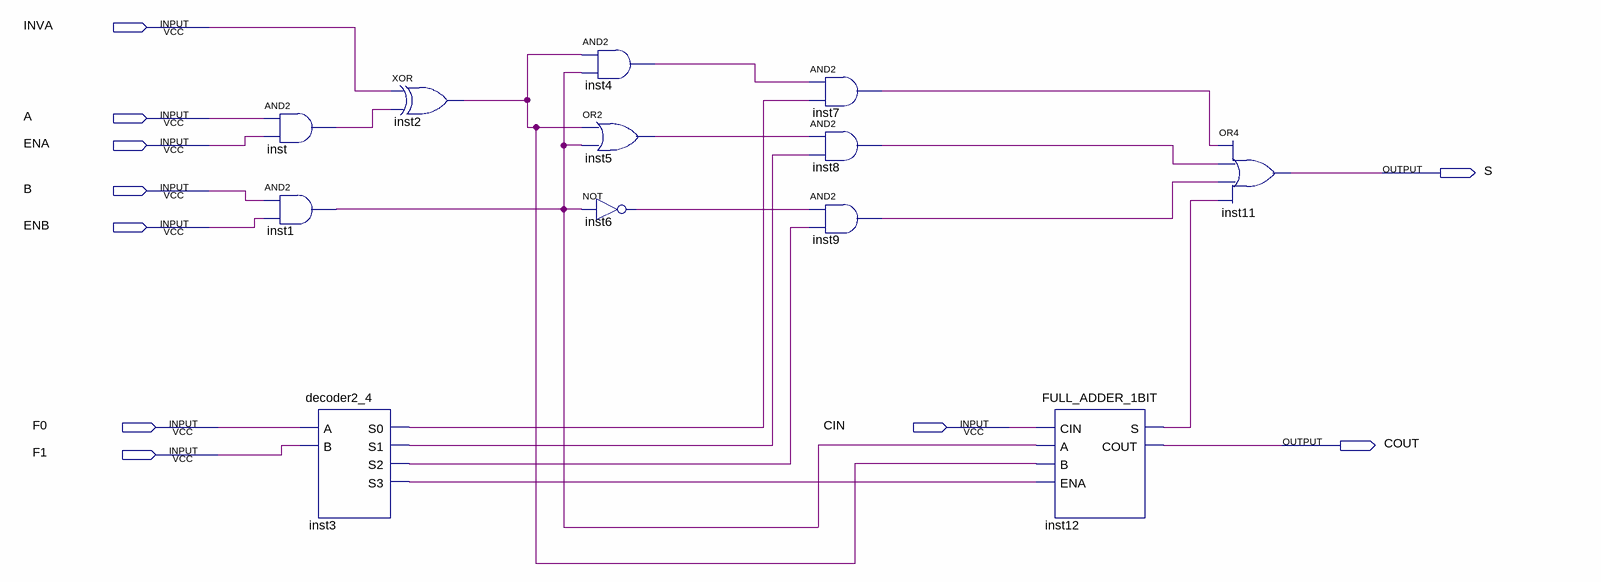
[diagram p0: schematic sheet]
// Quartus schematic ULA_1BIT.bdf as structural Verilog: 12 symbols, 10 pins
module ULA_1BIT (
  input  INVA,
  input  A,
  input  ENA,
  input  B,
  input  ENB,
  input  F0,
  input  CIN,
  input  F1,
  output S,
  output COUT
);

  wire inst1_out, inst2_out, inst3_s0, inst3_s1, inst3_s2, inst3_s3, inst4_out, inst5_out, inst6_out,
       inst7_out, inst8_out, inst9_out, inst12_s, inst_out;

  and inst (inst_out, A, ENA);
  and inst1 (inst1_out, B, ENB);
  decoder2_4 inst3 (.A(F0), .B(F1), .S0(inst3_s0), .S1(inst3_s1), .S2(inst3_s2), .S3(inst3_s3));
  xor inst2 (inst2_out, INVA, inst_out);
  and inst4 (inst4_out, inst2_out, inst1_out);
  or inst5 (inst5_out, inst2_out, inst1_out);
  not inst6 (inst6_out, inst1_out);
  and inst7 (inst7_out, inst4_out, inst3_s0);
  and inst8 (inst8_out, inst5_out, inst3_s1);
  and inst9 (inst9_out, inst6_out, inst3_s2);
  FULL_ADDER_1BIT inst12 (.CIN(CIN), .A(inst1_out), .B(inst2_out), .ENA(inst3_s3), .S(inst12_s), .COUT(COUT));
  or inst11 (S, inst7_out, inst8_out, inst9_out, inst12_s);
endmodule
